# Altium schematic sheet Sheet1.SchDoc
size A1
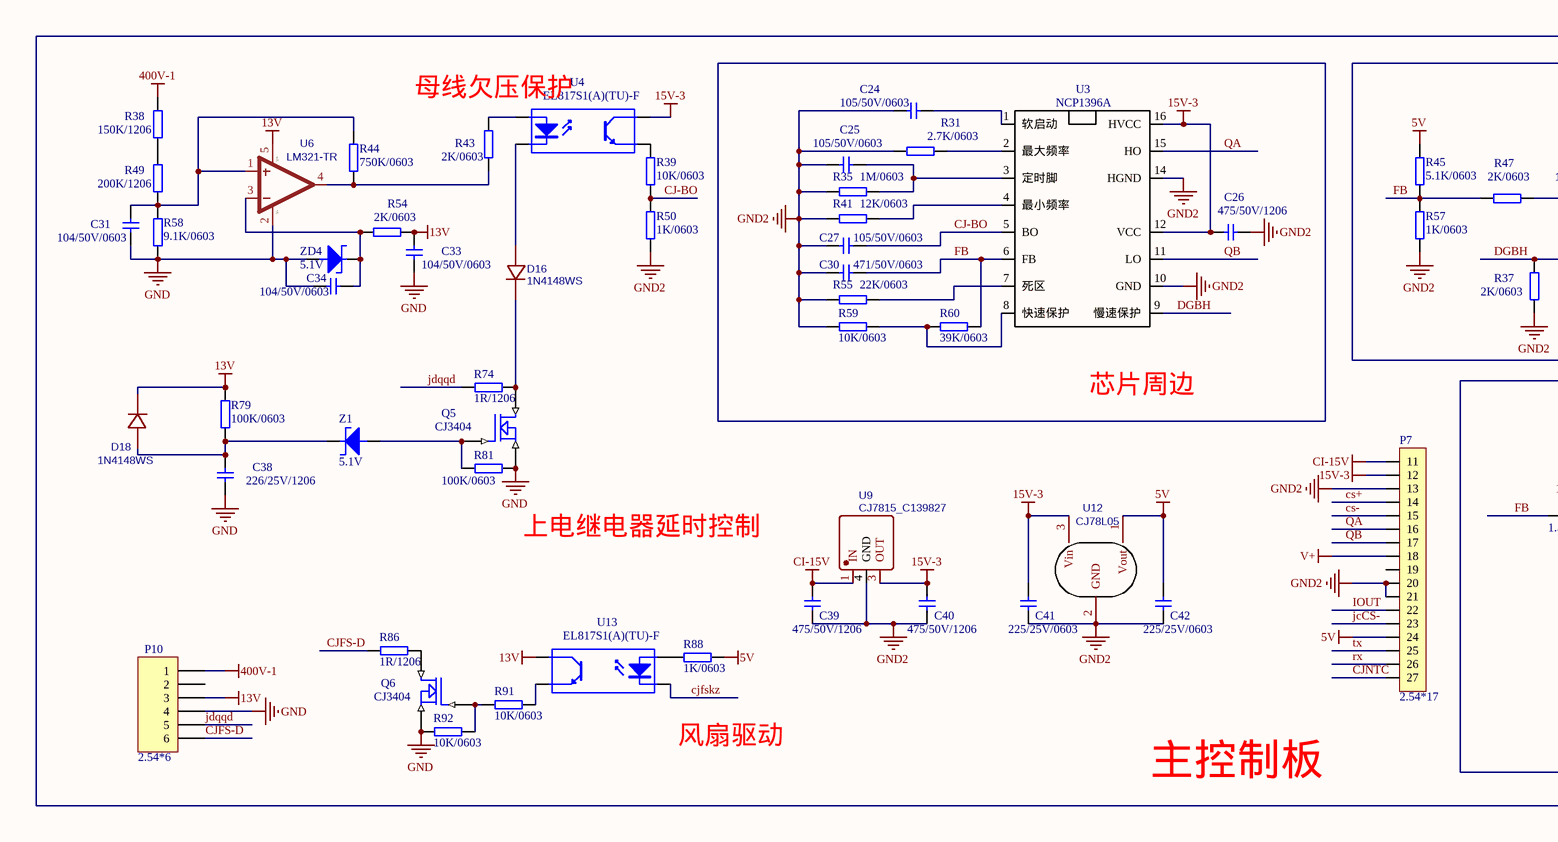
[diagram p0: Sheet1.SchDoc, left]
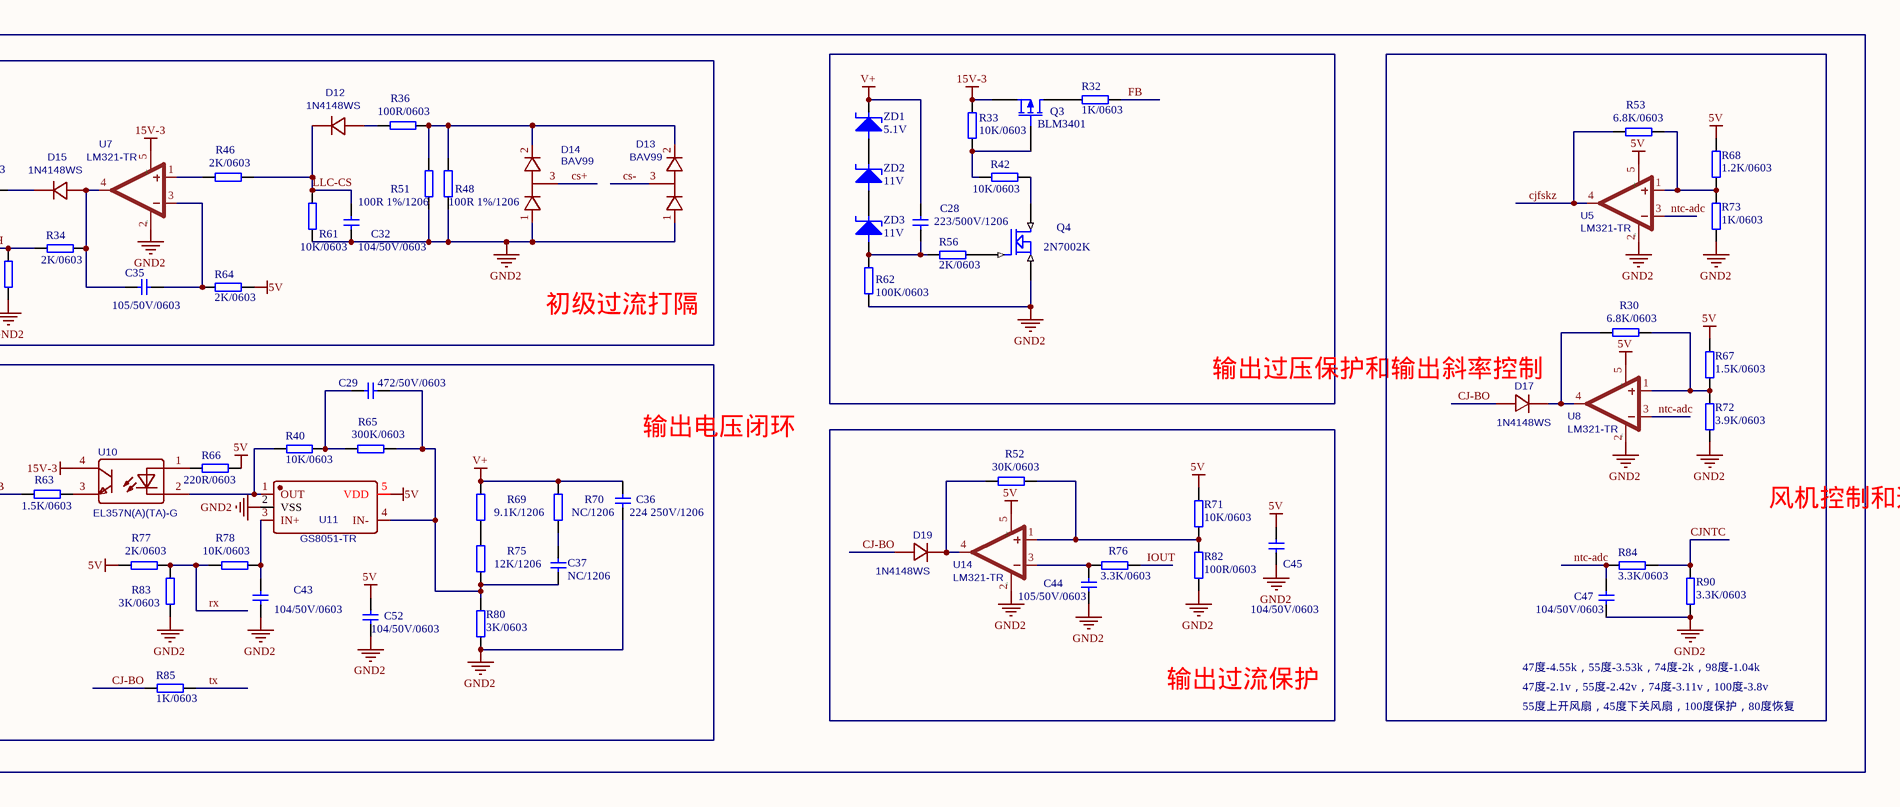
[diagram p1: Sheet1.SchDoc, right]

## Parts
C24  105/50V/0603  [0603]
C25  105/50V/0603  [0603]
C26  475/50V/1206  [1206]
C27  105/50V/0603  [0603]
C28  223/500V/1206  [1206]
C29  472/50V/0603  [0603]
C30  471/50V/0603  [0603]
C31  104/50V/0603  [0603]
C32  104/50V/0603  [0603]
C33  104/50V/0603  [0603]
C34  104/50V/0603  [0603]
C35  105/50V/0603  [0603]
C36  224 250V/1206  [1206]
C37  NC/1206  [1206]
C38  226/25V/1206  [1206]
C39  475/50V/1206  [1206]
C40  475/50V/1206  [1206]
C41  225/25V/0603  [0603]
C42  225/25V/0603  [0603]
C43  104/50V/0603  [0603]
C44  105/50V/0603  [0603]
C45  104/50V/0603  [0603]
C47  104/50V/0603  [0603]
C52  104/50V/0603  [0603]
D12  1N4148WS  [4148/323]
D13  BAV99  [SOT-23/BAV99]
D14  BAV99  [SOT-23/BAV99]
D15  1N4148WS  [4148/323]
D16  1N4148WS  [4148/323]
D17  1N4148WS  [4148/323]
D18  1N4148WS  [4148/323]
D19  1N4148WS  [4148/323]
P7  2.54*17  [控制主板次级排针]
P10  2.54*6  [控制主板-初级]
Q3  BLM3401  [SOT-23/PMOS]
Q4  2N7002K  [SOT-23/MOS]
Q5  CJ3404  [SOT-23/MOS]
Q6  CJ3404  [SOT-23/MOS]
R30  6.8K/0603  [0603]
R31  2.7K/0603  [0603]
R32  1K/0603  [0603]
R33  10K/0603  [0603]
R34  2K/0603  [0603]
R35  1M/0603  [0603]
R36  100R/0603  [0603]
R37  2K/0603  [0603]
R38  150K/1206  [1206]
R39  10K/0603  [0603]
R40  10K/0603  [0603]
R41  12K/0603  [0603]
R42  10K/0603  [0603]
R43  2K/0603  [0603]
R44  750K/0603  [0603]
R45  5.1K/0603  [0603]
R46  2K/0603  [0603]
R47  2K/0603  [0603]
R48  100R 1%/1206  [1206]
R49  200K/1206  [1206]
R50  1K/0603  [0603]
R51  100R 1%/1206  [1206]
R52  30K/0603  [0603]
R53  6.8K/0603  [0603]
R54  2K/0603  [0603]
R55  22K/0603  [0603]
R56  2K/0603  [0603]
R57  1K/0603  [0603]
R58  9.1K/0603  [0603]
R59  10K/0603  [0603]
R60  39K/0603  [0603]
R61  10K/0603  [0603]
R62  100K/0603  [0603]
R63  1.5K/0603  [0603]
R64  2K/0603  [0603]
R65  300K/0603  [0603]
R66  220R/0603  [0603]
R67  1.5K/0603  [0603]
R68  1.2K/0603  [0603]
R69  9.1K/1206  [1206]
R70  NC/1206  [1206]
R71  10K/0603  [0603]
R72  3.9K/0603  [0603]
R73  1K/0603  [0603]
R74  1R/1206  [1206]
R75  12K/1206  [1206]
R76  3.3K/0603  [0603]
R77  2K/0603  [0603]
R78  10K/0603  [0603]
R79  100K/0603  [0603]
R80  3K/0603  [0603]
R81  100K/0603  [0603]
R82  100R/0603  [0603]
R83  3K/0603  [0603]
R84  3.3K/0603  [0603]
R85  1K/0603  [0603]
R86  1R/1206  [1206]
R88  1K/0603  [0603]
R90  3.3K/0603  [0603]
R91  10K/0603  [0603]
R92  10K/0603  [0603]
U3  NCP1396A  [SOP16]
U4  EL817S1(A)(TU)-F  [EL817A]
U5  LM321-TR  [SOT23-5]
U6  LM321-TR  [SOT23-5]
U7  LM321-TR  [SOT23-5]
U8  LM321-TR  [SOT23-5]
U9  CJ7815_C139827  [to-252]
U10  EL357N(A)(TA)-G  [EL357]
U11  GS8051-TR  [SOT23-5]
U12  CJ78L05  [CJ78J05]
U13  EL817S1(A)(TU)-F  [EL817A]
U14  LM321-TR  [SOT23-5]
Z1  5.1V  [SOD-123]
ZD1  5.1V  [SOD-123]
ZD2  11V  [SOD-123]
ZD3  11V  [SOD-123]
ZD4  5.1V  [SOD-123]

## Nets
5V: C42.1 C45.1 C52.1 P7.24 R45.2 R64.2 R66.1 R67.2 R68.2 R71.2 R77.2 R88.1 U5.5(V+) U8.5(V+) U11.5(VDD) U12.1(Vout) U14.5(V+)
13V: C33.2 D18.1(C) P10.3 R54.2 R79.2 U6.5(V+) U13.4(C)
15V-3: C26.1 C40.1 C41.1 P7.12 Q3.3(S) R33.2 U3.12(VCC) U3.16(HVCC) U4.4(C) U7.5(V+) U9.3(OUT) U10.4(COL) U12.3(Vin)
400V-1: P10.1 R38.1
CI-15V: C39.1 P7.11 U9.1(IN)
GND: C31.1 C33.1 C34.2 C38.2 P10.4 Q5.S Q6.S R58.2 R81.1 R92.1 U6.2(V-) ZD4.1(A)
GND2: C24.2 C25.2 C26.2 C27.2 C30.2 C32.2 C36.2 C39.2 C40.2 C41.2 C42.2 C43.2 C44.2 C45.2 C47.2 C52.2 D13.1 D14.1 P7.13 P7.20 P7.21 Q4.S R31.1 R35.1 R37.1 R41.1 R48.2 R50.2 R51.2 R55.1 R57.1 R59.2 R61.1 R62.1 R72.1 R73.1 R80.1 R82.1 R83.2 R90.1 U3.10(GND) U3.14(HGND) U5.2(V-) U7.2(V-) U8.2(V-) U9.4(GND) U11.2(VSS) U12.2(GND) U14.2(V-)
V+: C28.1 C36.1 P7.18 R69.1 R70.1 ZD1.2(K)
CJ-BO: C27.1 D17.2(A) D19.2(A) R39.2 R50.1 R85.1 U3.5(BO)
CJFS-D: P10.6 R86.1
cjfskz: R53.1 U5.4(OUT) U13.2(K)
CJNTC: P7.27 R84.1 R90.2
cs+: D14.3 P7.14
cs-: D13.3 P7.15
DGBH: R34.2 R37.2 U3.9(慢速保护)
FB: C30.1 R32.1 R45.1 R47.1 R57.2 R60.1 R63.1 U3.6(FB)
IOUT: P7.22 R76.1
jcCS-: P7.23
jdqqd: P10.5 R74.1
LLC-CS: C32.1 D12.1(C) R46.2 R61.2
ntc-adc: C47.1 R84.2 U5.3(-IN) U8.3(-IN)
QA: P7.16 U3.15(HO)
QB: P7.17 U3.11(LO)
rx: P7.26 R77.1 R78.2 R83.1
tx: P7.25 R85.2
NetC24_1: C24.1 U3.1(软启动)
NetC25_1: C25.1 R35.2 U3.3(定时脚)
NetC28_2: C28.2 R56.2 R62.2 ZD3.1(A)
NetC29_1: C29.1 R40.1 R65.1
NetC29_2: C29.2 C37.2 R65.2 R75.2 R80.2 U11.4(IN-)
NetC31_2: C31.2 R44.2 R49.2 R58.1 U6.1(+IN)
NetC34_1: C34.1 R54.1 U6.3(-IN) ZD4.2(K)
NetC35_1: C35.1 D15.2(A) R34.1 U7.4(OUT)
NetC35_2: C35.2 R64.1 U7.3(-IN)
NetC37_1: C37.1 R70.2
NetC38_1: C38.1 D18.2(A) R79.1 Z1.2(K)
NetC43_1: C43.1 R78.1 U11.3(IN+)
NetC44_1: C44.1 R76.2 U14.3(-IN)
NetD12_2: D12.2(A) R36.1
NetD13_2: D13.2 D14.2 R36.2 R48.1 R51.1
NetD15_1: D15.1(C) R47.2
NetD16_1: D16.1(C) Q5.D R74.2
NetD16_2: D16.2(A) U4.2(K)
NetD17_1: D17.1(C) R30.2 U8.4(OUT)
NetD19_1: D19.1(C) R52.2 U14.4(OUT)
NetQ3_1: Q3.1(D) R32.2
NetQ3_2: Q3.2(G) R33.1 R42.2
NetQ4_D: Q4.D R42.1
NetQ4_G: Q4.G R56.1
NetQ5_G: Q5.G R81.2 Z1.1(A)
NetQ6_D: Q6.D R86.2
NetQ6_G: Q6.G R91.1 R92.2
NetR30_1: R30.1 R67.1 R72.2 U8.1(+IN)
NetR31_2: R31.2 U3.2(最大频率)
NetR38_2: R38.2 R49.1
NetR39_1: R39.1 U4.3(E)
NetR40_2: R40.2 U10.2(CA) U11.1(OUT)
NetR41_2: R41.2 U3.4(最小频率)
NetR43_1: R43.1 U4.1(A)
NetR43_2: R43.2 R44.1 U6.4(OUT)
NetR46_1: R46.1 U7.1(+IN)
NetR52_1: R52.1 R71.1 R82.2 U14.1(+IN)
NetR53_2: R53.2 R68.1 R73.2 U5.1(+IN)
NetR55_2: R55.2 U3.7(死区)
NetR59_1: R59.1 R60.2 U3.8(快速保护)
NetR63_2: R63.2 U10.3(EM)
NetR66_2: R66.2 U10.1(AN)
NetR69_2: R69.2 R75.1
NetR88_2: R88.2 U13.1(A)
NetR91_2: R91.2 U13.3(E)
NetZD1_1: ZD1.1(A) ZD2.2(K)
NetZD2_1: ZD2.1(A) ZD3.2(K)

Not connected (* = marked no-connect by the designer): P7 19; P10 2

## Notes on the sheet
- 母线欠压保护
- 初级过流打隔
- 芯片周边
- 输出电压闭环
- 输出过压保护和输出斜率控制
- (near R81) 上电继电器延时控制
- 风机控制和过温保护
- 输出过流保护
- 47度-4.55k，55度-3.53k，74度-2k，98度-1.04k
- 47度-2.1v，55度-2.42v，74度-3.11v，100度-3.8v
- (near U13) 风扇驱动
- 主控制板
- 55度上开风扇，45度下关风扇，100度保护，80度恢复

## Library data of the parts
C24-C45 C47 C52 = CAP: Capacitor
D12 D15-D19 = 1N4148WS-C99332: BOM_Manufacturer: MDD; BOM_Supplier: LCSC; BOM_Manufacturer Part: 1N4148WS; BOM_Supplier Part: C99332; spicePre: D; spiceSymbolName: 1N4148WS-C99332
D13 D14 = BAV99_C109206: BOM_Manufacturer: SK; Contributor: LCSC; SMT Type: Extend; BOM_Supplier: LCSC; BOM_Supplier Part: C109206; BOM_Manufacturer Part: BAV99; BOM_LCSC Assembly: Yes; spicePre: D; spiceSymbolName: BAV99_C109206
P7 = Component_2
P10 = Header 6: Header, 6-Pin; LatestRevisionDate: 17-Jul-2002; LatestRevisionNote: Re-released for DXP Platform.; Publisher: Altium Limited
Q3 = MOSFET-P: P-Channel MOSFET; Published: 8-Jun-2000; LatestRevisionDate: 17-Jul-2002; LatestRevisionNote: Re-released for DXP Platform.; PackageVersion: 1995/1996; PackageReference: E3; Publisher: Altium Limited
Q4-Q6 = MOSFET N
R30-R86 R88 R90-R92 = RES2
U3 = Component_1
U4 U13 = Optoisolator1: 4-Pin Phototransistor Optocoupler; Published: 24-Mar-1999; LatestRevisionDate: 04-Mar-2005; LatestRevisionNote: Sch pins 3 & 4 Swapped.; DatasheetVersion: Nov-2003; PackageReference: DIP-4; Publisher: Altium Limited
U5-U8 U14 = LM321-TR: BOM_Manufacturer: 3PEAK; SMT Type: Extend; BOM_Supplier: LCSC; BOM_Manufacturer Part: LM321-TR; BOM_Supplier Part: C97688; BOM_LCSC Assembly: Yes; spicePre: U; spiceSymbolName: LM321-TR
U9 = CJ7815_C139827: BOM_Manufacturer: Changjiang Electronics Tech (CJ); BOM_Manufacturer Part: CJ7815; Contributor: LCSC; SMT Type: Extend; BOM_Supplier: LCSC; BOM_Supplier Part: C139827; BOM_LCSC Assembly: Yes; spicePre: U; spiceSymbolName: CJ7815_C139827
U10 = EL357N(A)(TA)-G: BOM_Manufacturer: EVERLIGHT; Contributor: LCSC; SMT Type: Extend; BOM_Supplier: LCSC; BOM_Manufacturer Part: EL357N(A)(TA)-G; BOM_Supplier Part: C142286; BOM_LCSC Assembly: Yes; spicePre: U; spiceSymbolName: EL357N(A)(TA)-G
U11 = GS8051-TR: BOM_Manufacturer: Gainsil; Contributor: LCSC; SMT Type: Extend; BOM_Supplier: LCSC; BOM_Manufacturer Part: GS8051-TR; BOM_Supplier Part: C157721; BOM_LCSC Assembly: Yes; spicePre: U; spiceSymbolName: GS8051-TR
U12 = CJ78L05: BOM_Manufacturer: CJ; SMT Type: Extend; BOM_Supplier: LCSC; BOM_Manufacturer Part: CJ78L05; image: //image.lceda.cn/szlcsc/C2079.jpg; BOM_Supplier Part: C2079; BOM_LCSC Assembly: Yes; spicePre: U
Z1 ZD1-ZD4 = DIODE TUNNEL